# Altium schematic sheet MCU.SchDoc: MCU
size A4; Date: 09/02/2021; ApprovedBy: Rachid AKKOUCHE; CheckedBy: Rachid AKKOUCHE; Author: Rachid AKKOUCHE; DrawnBy: Rachid AKKOUCHE; Engineer: Rachid AKKOUCHE; DocumentNumber: BRA20210209_4; SheetNumber: 4; SheetTotal: 4; Dessinepar: Rachid AKKOUCHE; Property: Rachid AKKOUCHE; Time: 12:00; ProjectName: Projet BRA
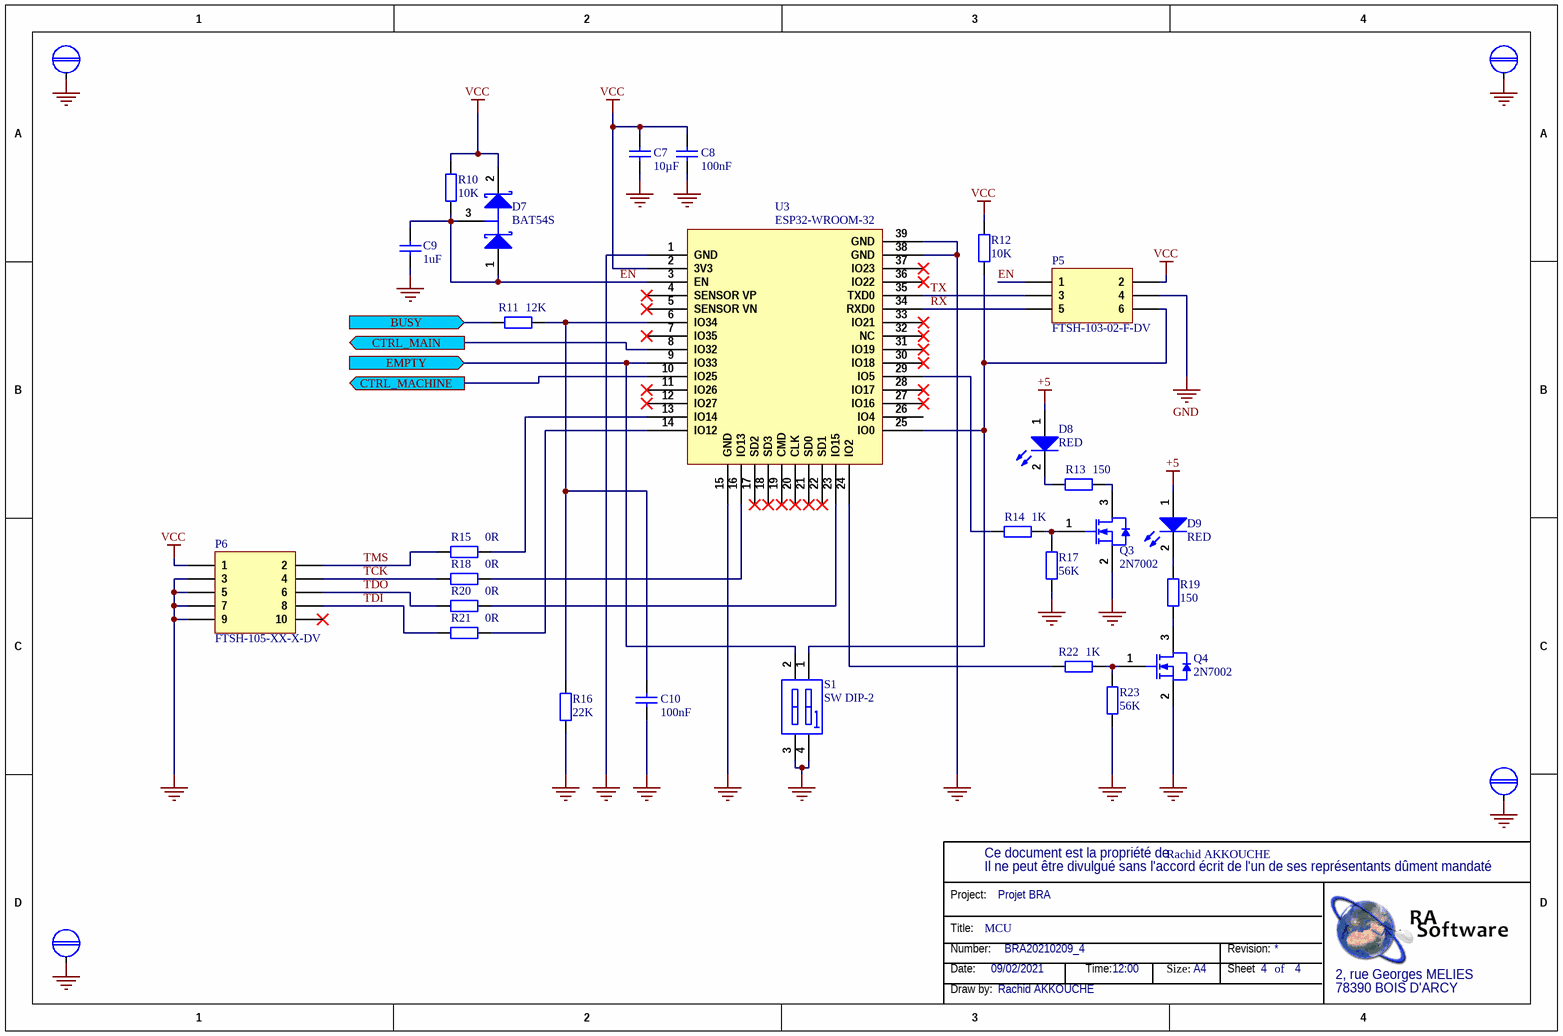
[diagram p0: MCU.SchDoc]

## Parts
C7  10µF  [C 0805(2012)x0.65]
C8  100nF  [C 0805(2012)x0.65]
C9  1uF  [C 0805(2012)x0.65]
C10  100nF  [C 0805(2012)x0.65]
D7  BAT54S  [SOT23]
D8  RED  [0603-LEDR]
D9  RED  [0603-LEDR]
P5  FTSH-103-02-F-DV  [SAMTEC_FTSH-103-02-F-DV]
P6  FTSH-105-XX-X-DV  [SAMTEC_FTSH-105-XX-X-DV]
Q3  2N7002  [SOT23]
Q4  2N7002  [SOT23]
R10  10K  [R 0805(2012)]
R11  12K  [R 0805(2012)]
R12  10K  [R 0805(2012)]
R13  150  [R 0805(2012)]
R14  1K  [R 0805(2012)]
R15  0R  [R 0805(2012)]
R16  22K  [R 0805(2012)]
R17  56K  [R 0805(2012)]
R18  0R  [R 0805(2012)]
R19  150  [R 0805(2012)]
R20  0R  [R 0805(2012)]
R21  0R  [R 0805(2012)]
R22  1K  [R 0805(2012)]
R23  56K  [R 0805(2012)]
S1  SW DIP-2  [DIP SWITCH 2 POS]
U3  ESP32-WROOM-32  [ESP32-WROOM-32X]
V1  VIS  [HOLE M4]  (value not drawn)
V2  VIS  [HOLE M4]  (value not drawn)
V3  VIS  [HOLE M4]  (value not drawn)
V4  VIS  [HOLE M4]  (value not drawn)

## Ports
BUSY (in), CTRL_MACHINE (out), CTRL_MAIN (out), EMPTY (in)

## Nets
+5: D8.1(A) D9.1(A)
GND: C7.2 C8.1 C9.2 C10.1 P5.4 P6.3 P6.5 P6.7 P6.9 Q3.2(S) Q4.2(S) R16.2 R17.1 R23.1 S1.3(B2) S1.4(B1) U3.1(GND) U3.15(GND) U3.38(GND) U3.39(GND) V1.1(GND) V2.1(GND) V3.1(GND) V4.1(GND)
VCC: C7.1 C8.2 D7.2(K) P5.2 P6.1 R10.2 R12.2 U3.2(3V3)
BUSY: R11.2 ; port BUSY
CTRL_MACHINE: U3.10(IO25) ; port CTRL_MACHINE
CTRL_MAIN: U3.8(IO32) ; port CTRL_MAIN
EMPTY: S1.2(A2) U3.9(IO33) ; port EMPTY
EN: C9.1 D7.1(A) D7.3(C) P5.1 R10.1 U3.3(EN)
RX: P5.5 U3.34(RXD0)
TCK: P6.4 R18.2
TDI: P6.8 R21.2
TDO: P6.6 R20.2
TMS: P6.2 R15.2
TX: P5.3 U3.35(TXD0)
NetC10_2: C10.2 R11.1 R16.1 U3.6(IO34)
NetD8_2: D8.2(K) R13.2
NetD9_2: D9.2(K) R19.2
NetP5_6: P5.6 R12.1 S1.1(A1) U3.25(IO0)
NetQ3_1: Q3.1(G) R14.1 R17.2
NetQ3_3: Q3.3(D) R13.1
NetQ4_1: Q4.1(G) R22.1 R23.2
NetQ4_3: Q4.3(D) R19.1
NetR14_2: R14.2 U3.29(IO5)
NetR15_1: R15.1 U3.13(IO14)
NetR18_1: R18.1 U3.16(IO13)
NetR20_1: R20.1 U3.23(IO15)
NetR21_1: R21.1 U3.14(IO12)
NetR22_2: R22.2 U3.24(IO2)

Not connected (* = marked no-connect by the designer): P6 10*; U3 4(SENSOR_VP)* 5(SENSOR_VN)* 7(IO35)* 11(IO26)* 12(IO27)* 17(SD2)* 18(SD3)* 19(CMD)* 20(CLK)* 21(SD0)* 22(SD1)* 26(IO4) 27(IO16)* 28(IO17)* 30(IO18)* 31(IO19)* 32(NC)* 33(IO21)* 36(IO22)* 37(IO23)*

## Notes on the sheet
- Project:
- Il ne peut être divulgué sans l'accord écrit de l'un de ses représentants dûment mandaté
- Ce document est la propriété de
- Title:
- Number:
- Date:
- Time:
- Size:
- A4
- Revision:
- Sheet
- of
- 2, rue Georges MELIES
- Draw by:
- 78390 BOIS D'ARCY

## Library data of the parts
C7 = Cap 0805 10uF: Capacitor non polarized 10µF SMD 0805; Capacitance: 10uF; Dielectric: X7R; Tolerance: 10%; Voltage: 16V; ComponentLink1URL: http://www.tme.eu/en/details/cc0805kkx5r5106/0805-mlcc-smd-capacitors/yageo/cc0805kkx5r5bb106/; ComponentLink1Description: http://www.tme.eu/en/details/cc0805kkx5r5106/0805-mlcc-smd-capacitors/yageo/cc0805kkx5r5bb106/; Case Code (Imperial): 0805; Case Code (Metric): 2012; Case/Package: 0805; Depth: 1.25mm; Height: 1.25mm; Lead Free: Lead Free; Length: 2mm; Max Operating Temperature: 85°C; Min Operating Temperature: -55°C; Mount: Surface Mount; Package Quantity: 1; Packaging: Tape and Reel; Radiation Hardening: No; Thickness: 0.055inch; Voltage Rating: 16V; Voltage Rating (DC): 16V; Width: 0.049inch; Supplier 1: TME; Supplier Part Number 1: CL21A106KOQNNNE
C8 C10 = Cap 0805 100nF: Capacitor; Manufacturer: MULTICOMP; Manufacturer Part Number: MCCA000296; Supplier 1: Farnell; Supplier Part Number 1: 1759167; Pricing 1: 100=0,01, 500=0,008, 1000=0,006, 4000=0,005 (EUR); ComponentLink1URL: http://www.farnell.com/datasheets/1520827.pdf; ComponentLink1Description: http://www.farnell.com/datasheets/1520827.pdf
C9 = Cap 0805 1uF: Capacitor; Manufacturer: MULTICOMP; Manufacturer Part Number: MCCA000549; Product Range: MULTICOMP - MCCA Series; Capacité: 1; Tolérance de capacité: +80%, -20%; Diélectrique: Y5; Type de boîtier de condensateur: 0805 [2012 Metric]; Type de packaging: Cut Tape; SVHC: No SVHC (20-Jun-2013); Capacitor Terminals: SMD; Température de fonctionnement: -30°C à +85; Supplier 1: Farnell; RoHS: YES; Pricing 1: 100=0,018, 500=0,012, 1000=0,009, 3000=0,006 (EUR); ComponentLink1URL: http://www.farnell.com/datasheets/1723208.pdf; ComponentLink1Description: http://www.farnell.com/datasheets/1723208.pdf; Supplier Part Number 1: 1759429
D7 = BAT54S: Schottky Barrier Double Diode; Manufacturer: MULTICOMP; Courant, If moy.: 200; Tension, Vrrm: 30; Tension, Vf max..: 400; Temps trr max.: 5; Courant, Ifs max.: 600; Type de boîtier diode: SOT-23; Nombre de broches: 3; SVHC: No SVHC (19-Dec-2012); Configuration diode: Dual Series; Température, Tj max..: 150; Type de terminaison: SMD; Température d'utilisation min: -55; Courant, If, Vf: 10; Courant, Ir, max..: 2; Marquage, CMS: L44; Température de fonctionnement: -55°C à +150; Supplier 1: Farnell; Supplier Part Number 1: 1621835; Manufacturer Part Number: BAT54S; RoHS: YES; Stock 1: 52055; Pricing 1: 10=0,102, 250=0,074, 1000=0,06, 3000=0,053 (EUR); Diode Type: Schottky; Type de boîtier: SOT-23; courant Ifsm: 600; ComponentLink1URL: http://www.farnell.com/datasheets/1317753.pdf; ComponentLink1Description: http://www.farnell.com/datasheets/1317753.pdf; Température de fonctionnement max..: 150
D8 D9 = HSMH-C190: Surface Mount Chip LED, Red; Manufacturer: AVAGO TECHNOLOGIES; Manufacturer Part Number: HSMH-C190.; Taille de lampe: 0.8mm x 1; Couleur de LED: Rouge; Intensité lumineuse: 17; Angle, vision: 170°; Courant, direct, If: 20; Tension, direct à  If: 1.8; Montage LED: CMS; Forme de lentille: Rectangulaire; Longueur d'onde typ.: 626; SVHC: No SVHC (19-Dec-2012); Dissipation de puissance: 65; Intensité lumineuse min. à  If: 2.8; Intensité lumineuse typique: 10; Largeur (externe): 0.8; Longueur d'onde dominante: 639; Longueur d'onde, crête: 630; Longueur/hauteur: 1.6; Matière: AlGaAs; Nombre de broches: 2; Orientation de montage opto: Dessus; Orientation sortie de lumière: Top Emitting; Température de fonctionnement: -30°C à +85; Température de fonctionnement max..: 85; Température, stockage min.: -40; Température d'utilisation min: -30; Tension, Vf max..: 2.6; Tension, Vf min.: 2.1; Type de LED: Standard; Supplier 1: Farnell; Supplier Part Number 1: 8554641; RoHS: YES; Pricing 1: 5=0,06, 25=0,059, 100=0,057, 250=0,052, 500=0,047 (EUR); MSL: MSL 2A - 4 semaines; Couleur, LED: Rouge; Profondeur: 0.8; Température, stockage max..: 85; Tension, Vf typ.: 1.8; ComponentLink1URL: http://www.farnell.com/datasheets/313031.pdf; ComponentLink1Description: http://www.farnell.com/datasheets/313031.pdf; ComponentLink2URL: http://www.farnell.com/datasheets/55927.pdf; ComponentLink2Description: http://www.farnell.com/datasheets/55927.pdf; Couleur: RED
P5 = FTSH-103-02-F-DV: Connector Header Surface Mount 6 position 0.050 (1.27mm); MF: Samtec; Availability: Unavailable; Value: *; Package: None; MP: FTSH-103-02-F-DV; Price: None
P6 = FTSH-105-XX-X-DV: Connector Header Surface Mount 10 position 0.050 (1.27mm); MF: Samtec; MP: FTSH-105-01-L-DV; SnapEDA_Link: https://www.snapeda.com/parts/FTSH-105-01-L-DV/Samtec/view-part/4795786/?ref=snap; Purchase-URL: https://pricing.snapeda.com/search/part/FTSH-105-01-L-DV/?ref=eda; Check_prices: https://www.snapeda.com/parts/FTSH-105-01-L-DV/Samtec/view-part/4795786/?ref=eda; Value: *; Availability: Bad; Price: None; Package: None
Q3 Q4 = 2N7002: N-channel Enhancement Mode Field-effect Transistor; Manufacturer: FAIRCHILD SEMICONDUCTOR; Supplier 1: Farnell; Supplier Part Number 1: 9845313; Manufacturer Part Number: 2N7002; RoHS: YES; Pricing 1: 5=0,138, 25=0,13, 100=0,059, 1000=0,049, 3000=0,026, 6000=0,0234 (EUR); ComponentLink1URL: http://www.farnell.com/datasheets/660093.pdf; ComponentLink1Description: http://www.farnell.com/datasheets/660093.pdf; ComponentLink2URL: http://www.farnell.com/datasheets/410597.pdf; ComponentLink2Description: http://www.farnell.com/datasheets/410597.pdf
R10 R12 = Resistor 0805 10K: Resistor SMD 0805 10K; Manufacturer: MULTICOMP; Manufacturer Part Number: MC0.1W08051%10KFR; Product Range: MULTICOMP - MC Series; Résistance: 10; Puissance: 100; Tolérance de résistance: ± 1%; Type de boîtier de résistance: 0805; Type de résistance: Couche épaisse; Coefficient de température: ± 100; Tension: 150; Type de packaging: Full Reel; Resistor Mounting: CMS; Supplier 1: Farnell; RoHS: YES; Pricing 1: 5000=0,001 (EUR); MSL: MSL 1 - Illimité; ComponentLink1URL: http://www.farnell.com/datasheets/1716700.pdf; ComponentLink1Description: http://www.farnell.com/datasheets/1716700.pdf; Supplier Part Number 1: 2129195
R11 = Resistor 0805 12K: Resistor SMD 0805 12K; Manufacturer: Royal Electronic Factory; Manufacturer Part Number: 0805S8J0123T5E; RoHS: Yes; RoHS Compliant: Yes
R13 R19 = Resistor 0805 150: Resistor SMD 0805 150; Manufacturer: YAGEO; Manufacturer Part Number: RC0805JR-07150KL; Unit: pcs; SuppliedAmount: 0; MinAmount: 100; Resistance: 150kΩ; Power: 0.125W; Tolerance: ±5%; Max. operating voltage: 150V; Max. overload voltage: 300V; Supplier 1: TME; Category: 0805 SMD Resistors; Stock 1: 6800; Pricing 1: 100=0.00566, 1000=0.0034, 5000=0.00111, 15000=0.00102, 50000=0.00088 (EUR); Weight: 0.028; Multiples: 100; Resistor type: thick film; Mounting: SMD; Case: 0805; Operating temperature: -55...155°C; Price Type: NET; ComponentLink1URL: http://static.tme.eu/products_pics/6/6/c/66cc5cd64257edd80ca8e9fd2040972d/56038.jpg; ComponentLink1Description: http://static.tme.eu/products_pics/6/6/c/66cc5cd64257edd80ca8e9fd2040972d/56038.jpg; Supplier Part Number 1: RC0805JR-07150K
R14 R22 = Resistor 0805 1K: Resistor SMD 0805 1K; Manufacturer: MULTICOMP; Manufacturer Part Number: MC0.1W08051%1KFR; Product Range: MULTICOMP - MC Series; Résistance: 1; Puissance: 100; Tolérance de résistance: ± 1%; Type de boîtier de résistance: 0805; Type de résistance: Couche épaisse; Coefficient de température: ± 100; Tension: 150; Type de packaging: Full Reel; Resistor Mounting: CMS; Supplier 1: Farnell; RoHS: YES; Pricing 1: 5000=0,001 (EUR); MSL: MSL 1 - Illimité; ComponentLink1URL: http://www.farnell.com/datasheets/1716700.pdf; ComponentLink1Description: http://www.farnell.com/datasheets/1716700.pdf; Supplier Part Number 1: 2129113
R15 R18 R20 R21 = Resistor 0805 0R: Resistor or Jumper; Manufacturer: MULTICOMP; Manufacturer Part Number: MCMR08X000 PTL; Product Range: MULTICOMP - MCMR Series; Résistance: 0; Puissance: 125; Tolérance de résistance: ± 0.05; Type de boîtier de résistance: 0805; Type de résistance: Céramique; Coefficient de température: -200ppm/°C à +400; Tension: 150; Type de packaging: Cut Tape; Resistor Mounting: CMS; Supplier 1: Farnell; Supplier Part Number 1: 2073603; RoHS: YES; Pricing 1: 100=0,011, 500=0,009, 1000=0,008 (EUR); MSL: MSL 1 - Illimité; ComponentLink1URL: http://www.farnell.com/datasheets/1716708.pdf; ComponentLink1Description: http://www.farnell.com/datasheets/1716708.pdf
R16 = Resistor 0805 22K: Resistor SMD 0805 22K; Manufacturer: Royal Electronic Factory; Manufacturer Part Number: 0805S8J0223T5E; RoHS: Yes; RoHS Compliant: Yes; Supplier 1: TME; Supplier Part Number 1: SMD0805-22K
R17 R23 = Resistor 0805 56K: Resistor; Manufacturer: MULTICOMP; Manufacturer Part Number: MC0.1W08051%56KFR; Product Range: MULTICOMP - MC Series; Résistance: 56; Puissance: 100; Tolérance de résistance: ± 1%; Type de boîtier de résistance: 0805; Type de résistance: Couche épaisse; Coefficient de température: ± 100; Tension: 150; Type de packaging: Full Reel; Resistor Mounting: CMS; Resistor Terminals: (Non Disponible); Supplier 1: Farnell; RoHS: YES; Pricing 1: 5000=0,001 (EUR); MSL: (Non Applicable); ComponentLink1URL: http://www.farnell.com/datasheets/1716700.pdf; ComponentLink1Description: http://www.farnell.com/datasheets/1716700.pdf; Supplier Part Number 1: 2129258
S1 = SW DIP-2: DIP Switch, 2 Position, SPST; Published: 24-Mar-1999; LatestRevisionDate: 17-Jul-2002; LatestRevisionNote: Re-released for DXP Platform.; PackageReference: DIP-4; Publisher: Altium Limited
U3 = ESP32-WROOM-32x